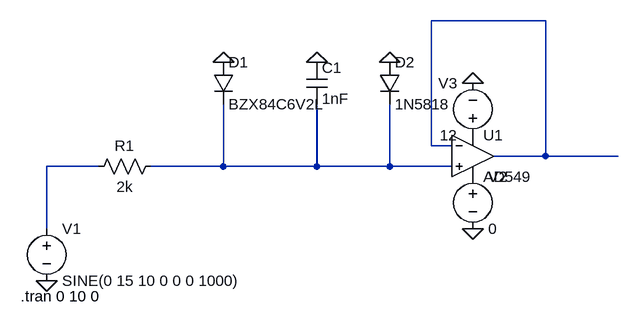
[diagram p0: schematic 0-3V Conditioning Circuit Final.asc]
0-3V Conditioning Circuit Final.asc, the LTspice schematic file:
Version 4.1
SHEET 1 932 680
WIRE 816 -192 640 -192
WIRE 640 0 640 -192
WIRE 672 0 640 0
WIRE 816 16 816 -192
WIRE 816 16 736 16
WIRE 928 16 816 16
WIRE 128 32 48 32
WIRE 320 32 320 -64
WIRE 320 32 208 32
WIRE 464 32 464 -64
WIRE 464 32 320 32
WIRE 576 32 576 -64
WIRE 576 32 464 32
WIRE 672 32 576 32
WIRE 48 128 48 32
FLAG 48 208 0
FLAG 320 -128 0
FLAG 464 -128 0
FLAG 576 -128 0
FLAG 704 -96 0
FLAG 704 128 0
SYMBOL voltage 48 112 R0
WINDOW 123 0 0 Left 0
WINDOW 39 0 0 Left 0
SYMATTR InstName V1
SYMATTR Value SINE(0 15 10 0 0 0 1000)
SYMBOL res 224 16 R90
WINDOW 0 0 56 VBottom 2
WINDOW 3 32 56 VTop 2
SYMATTR InstName R1
SYMATTR Value 2k
SYMBOL diode 304 -128 R0
SYMATTR InstName D1
SYMATTR Value BZX84C6V2L
SYMBOL diode 560 -128 R0
SYMATTR InstName D2
SYMATTR Value 1N5818
SYMBOL cap 448 -128 R0
SYMATTR InstName C1
SYMATTR Value 1nF
SYMBOL OpAmps\\AD549 704 -48 R0
SYMATTR InstName U1
SYMBOL voltage 704 32 R0
WINDOW 123 0 0 Left 0
WINDOW 39 0 0 Left 0
SYMATTR InstName V2
SYMATTR Value 0
SYMBOL voltage 704 0 R180
WINDOW 0 24 96 Left 2
WINDOW 3 24 16 Left 2
WINDOW 123 0 0 Left 0
WINDOW 39 0 0 Left 0
SYMATTR InstName V3
SYMATTR Value 12
TEXT 8 232 Left 2 !.tran 0 10 0

The netlist it stands for:
* 0-3V Conditioning Circuit Final.asc
V1 N002 0 SINE(0 15 10 0 0 0 1000)
R1 N003 N002 2k
D1 0 N003 BZX84C6V2L
D2 0 N003 1N5818
C1 0 N003 1nF
X§U1 N003 N001 P001 P002 N001 AD549  ; pins In+ In- V+ V- OUT
V2 P002 0 0
V3 P001 0 12
.model D D
.lib standard.dio
.tran 0 10 0
.backanno
.end